# EAGLE schematic windidr (EAGLE 9.6.2)
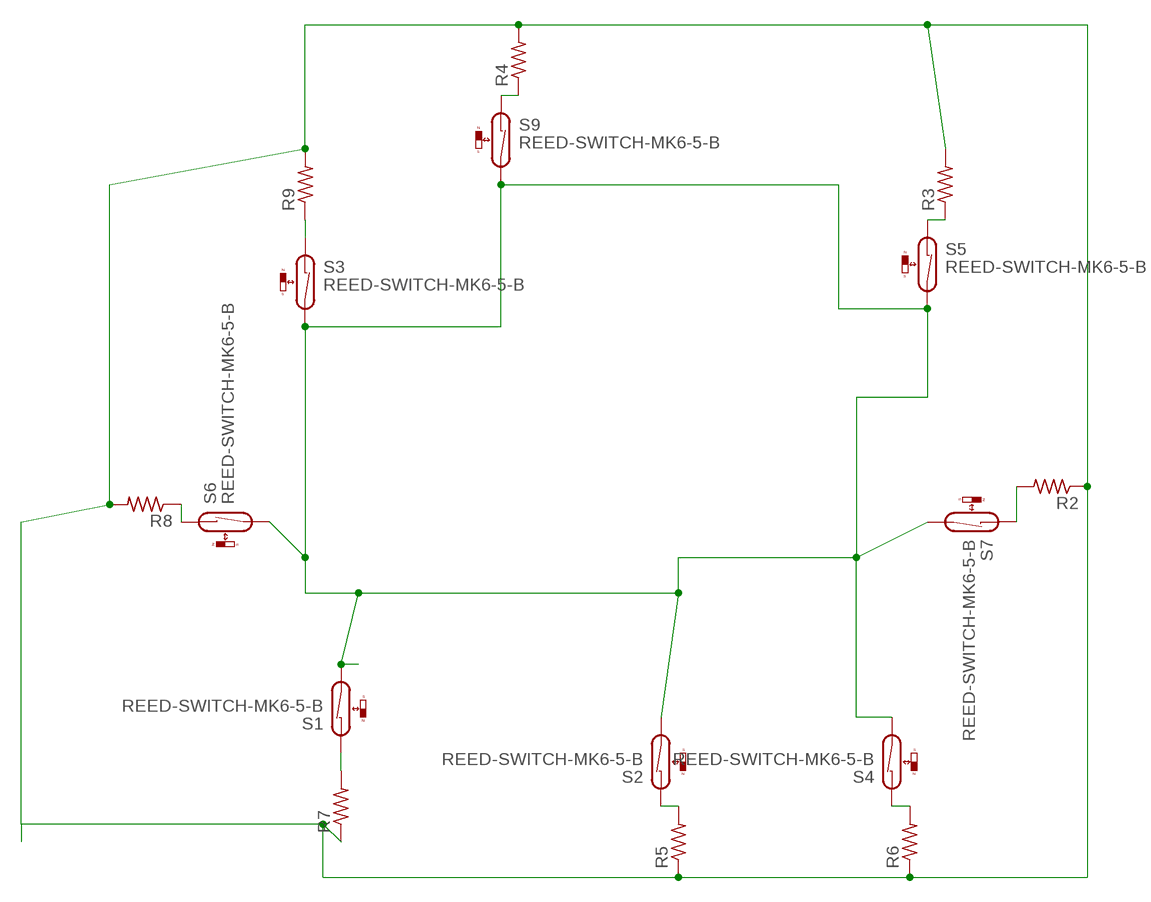
[diagram p0: schematic, sheet 1]

## Parts
R2  R-US_0309/10  [0309/10]
R3  R-US_0309/10  [0309/10]
R4  R-US_0309/10  [0309/10]
R5  R-US_0309/10  [0309/10]
R6  R-US_0309/10  [0309/10]
R7  R-US_0309/10  [0309/10]
R8  R-US_0309/10  [0309/10]
R9  R-US_0309/10  [0309/10]
S1  REED-SWITCH-MK6-5-B  [MK6-5]
S2  REED-SWITCH-MK6-5-B  [MK6-5]
S3  REED-SWITCH-MK6-5-B  [MK6-5]
S4  REED-SWITCH-MK6-5-B  [MK6-5]
S5  REED-SWITCH-MK6-5-B  [MK6-5]
S6  REED-SWITCH-MK6-5-B  [MK6-5]
S7  REED-SWITCH-MK6-5-B  [MK6-5]
S9  REED-SWITCH-MK6-5-B  [MK6-5]

## Nets
N$1: S1.2 S2.2 S3.2 S4.2 S5.2 S6.2 S7.2 S9.2
N$2: R4.1 S9.1
N$3: R6.2 S4.1
N$4: R3.1 S5.1
N$5: R2.2 S7.1
N$6: R5.2 S2.1
N$7: R7.2 S1.1
N$8: R8.1 S6.1
N$9: R2.1 R3.2 R4.2 R5.1 R6.1 R7.1 R8.2 R9.2
N$10: R9.1 S3.1

## Library data of the parts
R2-R9 = rcl:R-US_: RESISTOR, American symbol; SPICEPREFIX: R
S1-S7 S9 = switch-reed:REED-SWITCH-: Reed Sensor; MF: MEDER; MPN: MK6-5-B; OC_FARNELL: 1079479